# Altium project Microswift REV 2.1B (2L).PrjPcb
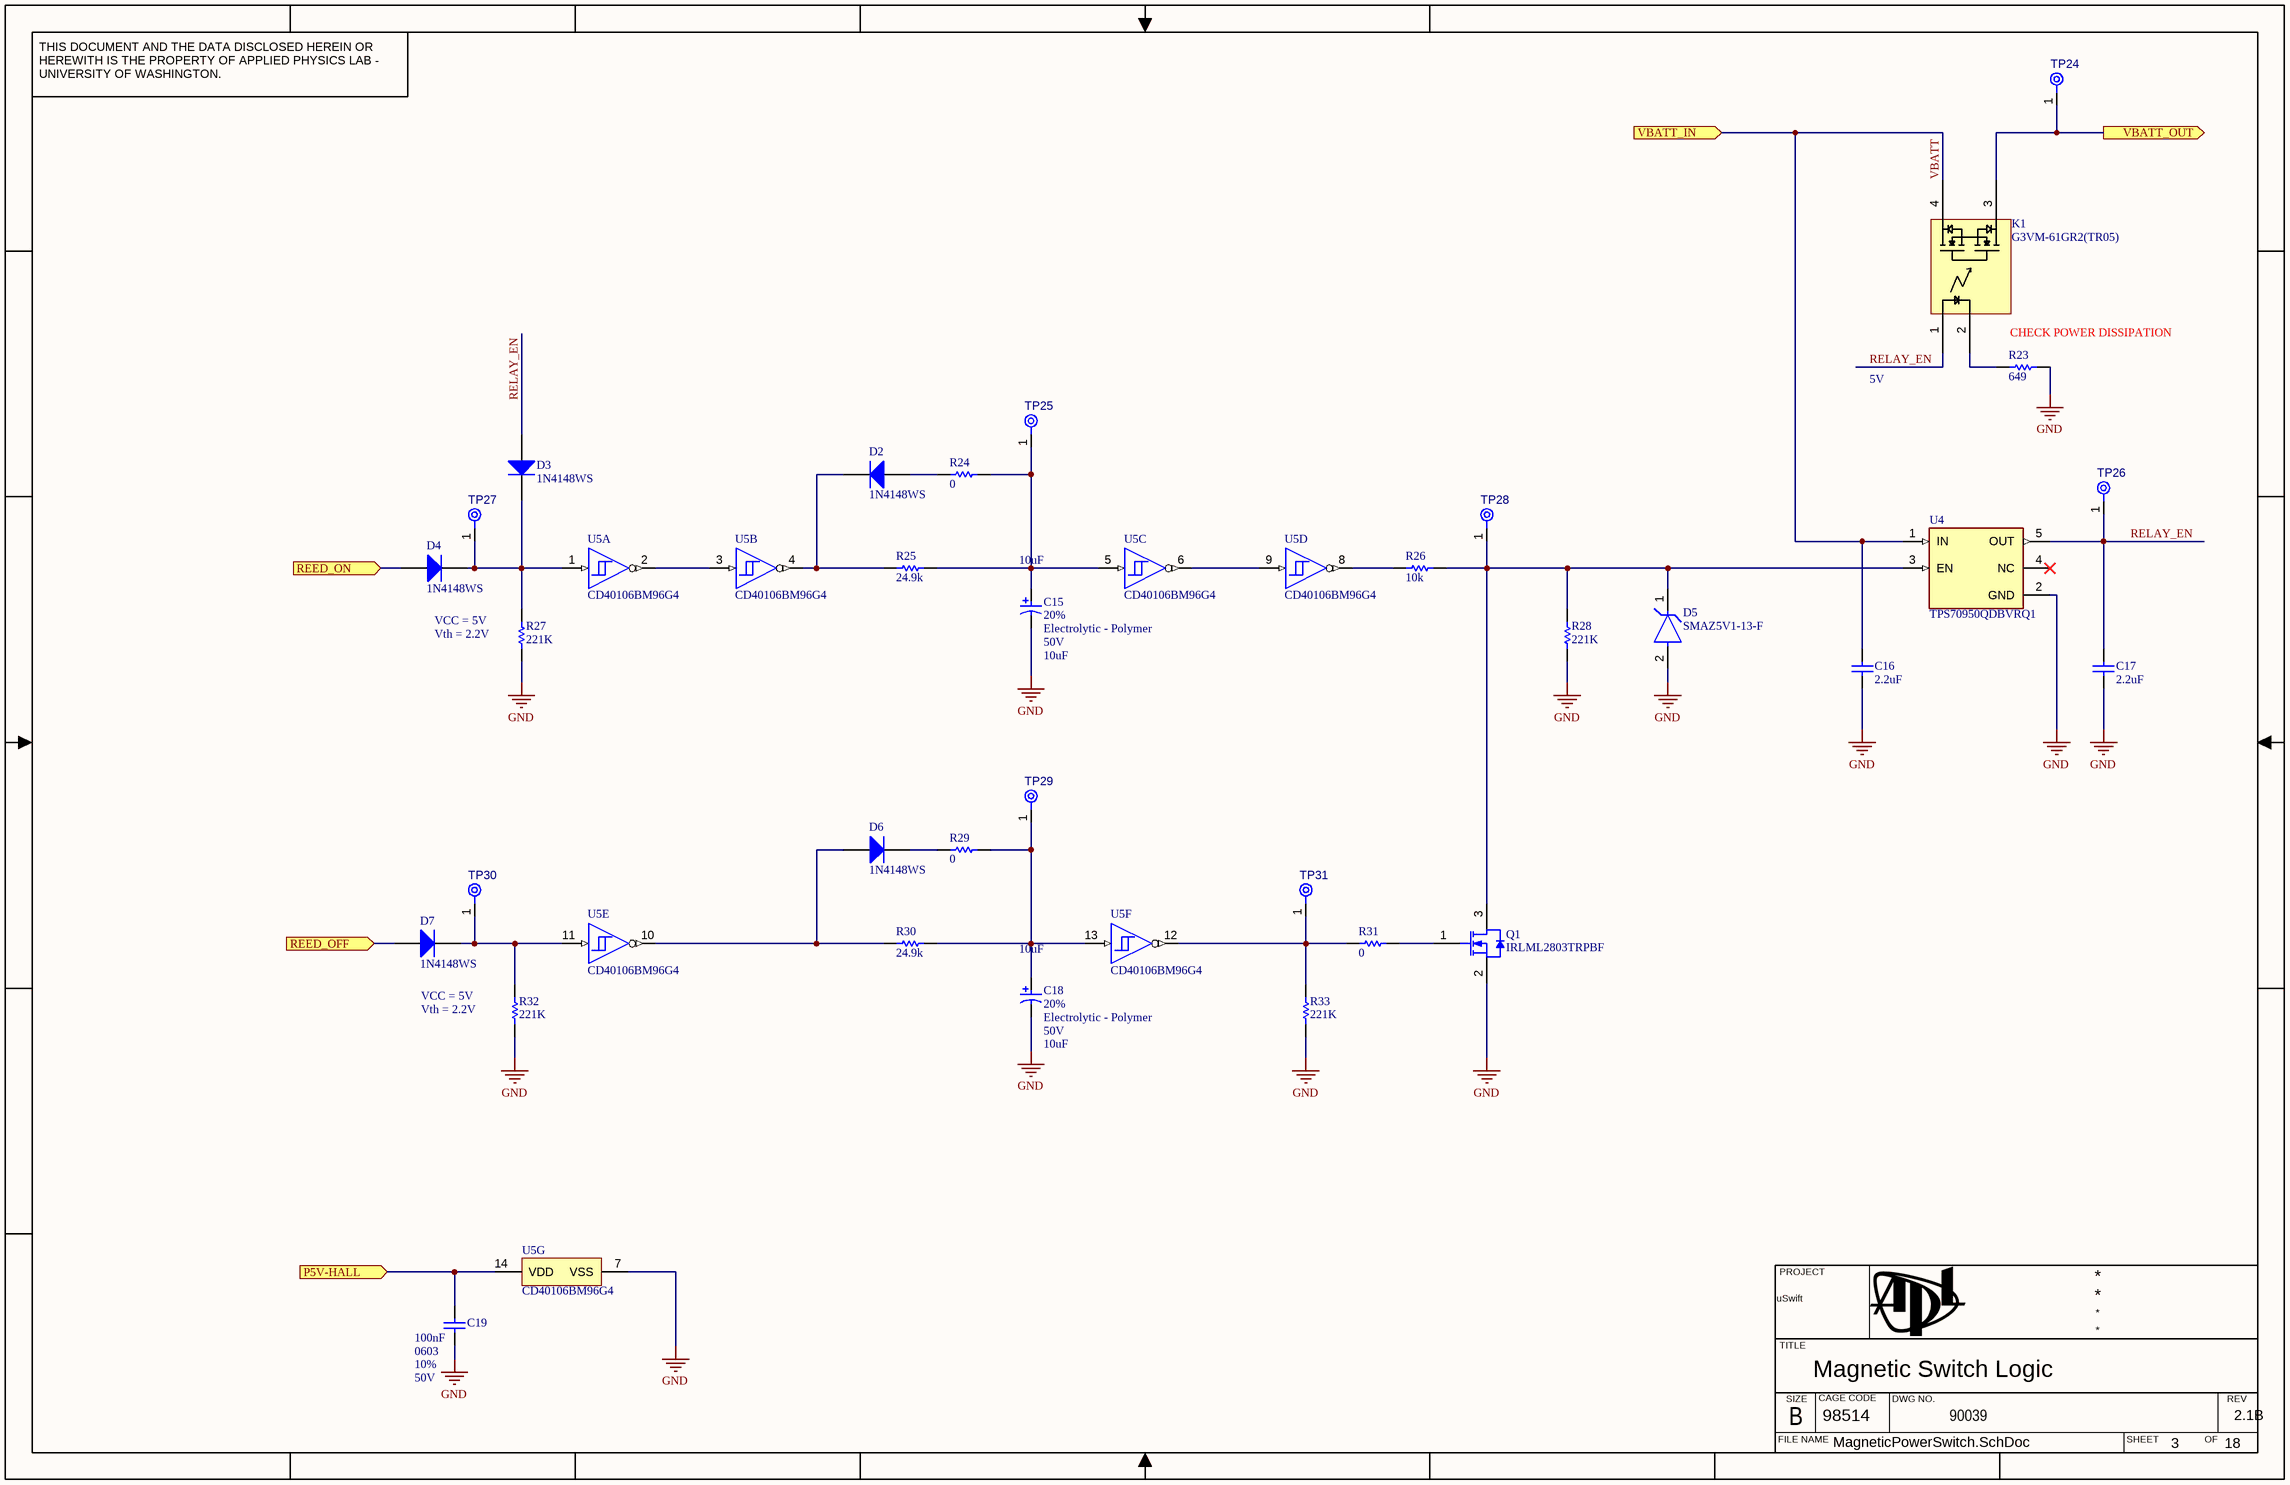
[diagram p0: MagneticPowerSwitch.SchDoc]
Gbl_Revision: 2.1B; Gbl_PROJECTTITLE: MicroSwift 2L PCB; Gbl_Project: uSwift; Gbl_PCB_DWG_NO: 90035; Gbl_ENG_APP_DATE: 2023/04/28; Gbl_Engineer: BSALMI; Gbl_DSN_BOM_DATE: 2024-08-20; Gbl_DSN_APP_DATE: 2024-08-20; Gbl_DrawnBy: BSALMI; Gbl_DOC_NO_SCH_DWG: 90039; Gbl_DOC_NO_FAB_DWG: 90038; Gbl_DOC_NO_BOM: 90037; Gbl_DOC_NO_ASSY_DWG: 90039; GBL_CHK_APP_DATE: 2023/04/28; Gbl_CheckedBy: BCHAM; Gbl_Cage: 98514
3 sheets, 57 parts. Net scope: hierarchical (ports join the sheet entries above them; power ports are global).
Board file: PCB_MicroSwift_2L_6Layer_Sunstone.PcbDoc
Sheets:
  MagneticPowerSwitch.SchDoc
  PowerSwitch_P12V.SchDoc
  P5V_Regulator.SchDoc

## Sheet MagneticPowerSwitch.SchDoc: Magnetic Switch Logic
size 431 x 279 mm; DocumentNumber: 3; SheetNumber: 3; SheetTotal: 18; ENG_APP_DATE: --/--/--; DSN_APP_DATE: --/--/--; CHK_APP_DATE: --/--/--

### Parts
C15  value 10uF  Tolerance: 20%  Material: Electrolytic - Polymer  Voltage Rating: 50V  Capacitance: 10uF  [CAPAE5953X61M]  (hidden comment: EEH-ZA1H100R)
C16  value 2.2uF  [CAPC3225X270X30ML30]  (hidden comment: Capacitor 2.2uF 10%, 50V, X7R, 1210)
C17  value 2.2uF  [CAPC3225X270X30ML30]  (hidden comment: Capacitor 2.2uF 10%, 50V, X7R, 1210)
C18  value 10uF  Tolerance: 20%  Material: Electrolytic - Polymer  Voltage Rating: 50V  Capacitance: 10uF  [CAPAE5953X61M]  (hidden comment: EEH-ZA1H100R)
C19  value 100nF  Case/Package: 0603  Tolerance: 10%  Voltage Rating: 50V  [CAPC1608X90X40ML10T20]  (hidden comment: Capacitor 100nF +/- 10%, 50V, X7R, 0603)
D2  1N4148WS  [FAIR-SOD-323_V]
D3  1N4148WS  [FAIR-SOD-323_V]
D4  1N4148WS  [FAIR-SOD-323_V]
D5  SMAZ5V1-13-F  [FP-SMA-MFG]
D6  1N4148WS  [FAIR-SOD-323_V]
D7  1N4148WS  [FAIR-SOD-323_V]
K1  G3VM-61GR2(TR05)  [G3VM-61GR2(TR05)-Footprint-1]
Q1  IRLML2803TRPBF  [SOT95P237X112-3M]
R23  value 649  [RESC1609X50X30ML08T20]  (hidden comment: Resistor 649R +/-1% 0603 100 mW)
R24  value 0  [RESC1608X55X25ML10T15]  (hidden comment: Resistor 0R +/- 5% 0603 100 mW)
R25  value 24.9k  [RESC1608X55X25ML10T15]  (hidden comment: Resistor 24K9 +/-1% 0603 100 mW)
R26  value 10k  [RESC1608X55X25ML10T15]  (hidden comment: Resistor 10k +/-1% 0603 100 mW)
R27  value 221K  [RESC1609X50X30ML08T20]  (hidden comment: Resistor 221K +/-1% 0603 100 mW)
R28  value 221K  [RESC1609X50X30ML08T20]  (hidden comment: Resistor 221K +/-1% 0603 100 mW)
R29  value 0  [RESC1608X55X25ML10T15]  (hidden comment: Resistor 0R +/- 5% 0603 100 mW)
R30  value 24.9k  [RESC1608X55X25ML10T15]  (hidden comment: Resistor 24K9 +/-1% 0603 100 mW)
R31  value 0  [RESC1608X55X25ML10T15]  (hidden comment: Resistor 0R +/- 5% 0603 100 mW)
R32  value 221K  [RESC1609X50X30ML08T20]  (hidden comment: Resistor 221K +/-1% 0603 100 mW)
R33  value 221K  [RESC1609X50X30ML08T20]  (hidden comment: Resistor 221K +/-1% 0603 100 mW)
TP24  TPAD6R-CIRCLED  [TP06R - Circled]  (value not drawn)  (no BOM)
TP25  TPAD6R-CIRCLED  [TP06R - Circled]  (value not drawn)  (no BOM)
TP26  TPAD6R-CIRCLED  [TP06R - Circled]  (value not drawn)  (no BOM)
TP27  TPAD6R-CIRCLED  [TP06R - Circled]  (value not drawn)  (no BOM)
TP28  TPAD6R-CIRCLED  [TP06R - Circled]  (value not drawn)  (no BOM)
TP29  TPAD6R-CIRCLED  [TP06R - Circled]  (value not drawn)  (no BOM)
TP30  TPAD6R-CIRCLED  [TP06R - Circled]  (value not drawn)  (no BOM)
TP31  TPAD6R-CIRCLED  [TP06R - Circled]  (value not drawn)  (no BOM)
U4  TPS70950QDBVRQ1  [FP-DBV0005A-IPC_A]
U5  CD40106BM96G4  [D0014A_M]  (parts A,B,C,D,E,F,G of 7)

### Ports
P5V-HALL (in), REED_OFF (in), REED_ON (in), VBATT_IN (in), VBATT_OUT (out)

### Nets
GND: C15.2 C16.1 C17.1 C18.2 C19.1 D5.2(A) Q1.2(S) R23.1 R27.1 R28.1 R32.1 R33.1 U4.2(GND) U5.7(VSS)
RELAY_EN: C17.2 D3.1(A) K1.1(+_CNTL) TP26.1(TP) U4.5(OUT)
VBATT: C16.2 K1.4(DRAIN) U4.1(IN) ; port VBATT_IN
NetC15_1: C15.1 R24.2 R25.2 TP25.1(TP) U5.5(C)
NetC18_1: C18.1 R29.2 R30.2 TP29.1(TP) U5.13(F)
NetC19_2: C19.2 U5.14(VDD) ; port P5V-HALL
NetD2_1: D2.1(A) R24.1
NetD2_2: D2.2(K) R25.1 U5.4(H=~{B})
NetD3_2: D3.2(K) D4.2(K) R27.2 TP27.1(TP) U5.1(A)
NetD4_1: D4.1(A) ; port REED_ON
NetD5_1: D5.1(C) Q1.3(D) R26.2 R28.2 TP28.1(TP) U4.3(EN)
NetD6_1: D6.1(A) R30.1 U5.10(K=~{E})
NetD6_2: D6.2(K) R29.1
NetD7_1: D7.1(A) ; port REED_OFF
NetD7_2: D7.2(K) R32.2 TP30.1(TP) U5.11(E)
NetK1_2: K1.2(-_CNTL) R23.2
NetK1_3: K1.3(DRAIN) TP24.1(TP) ; port VBATT_OUT
NetQ1_1: Q1.1(G) R31.2
NetR26_1: R26.1 U5.8(J=~{D})
NetR31_1: R31.1 R33.2 TP31.1(TP) U5.12(L=~{F})
NetU5_2: U5.2(G=~{A}) U5.3(B)
NetU5_6: U5.6(I=~{C}) U5.9(D)

Not connected (* = marked no-connect by the designer): U4 4(NC)*

### Notes on the sheet
- CHECK POWER DISSIPATION
- 5V
- VCC = 5V
- (near R27) Vth = 2.2V
- (near R32) Vth = 2.2V
- THIS DOCUMENT AND THE DATA DISCLOSED HEREIN OR HEREWITH IS THE PROPERTY OF APPLIED PHYSICS LAB - UNIVERSITY OF WASHINGTON.
- PROJECT
- TITLE
- FILE NAME
- SIZE
- B
- CAGE CODE
- DWG NO.
- SHEET
- OF
- REV

### Library data of the parts
C15 C18 = CMP-001-00213-11: Cap Aluminum 10uF 50V 20% (5 X 5.8mm) SMD 0.12 Ohm 750mA 5000 hr 105°C Embossed T/R; Manufacturer: Panasonic; ESR (Equivalent Series Resistance): 120mR; Series: ZA; Min Operating Temperature: -55°C; Max Operating Temperature: 105°C; Mount: Surface Mount; Case/Package: Radial; Decade: 10uF; Ripple Current: 750mA; Part Number: EEH-ZA1H100R
C16 C17 = CMP-001-00182-9: Chip Capacitor, 2.2uF, 10%, 50 V, X7R 1210 (3225 Metric); Decade: 1uF; Capacitor Type: Ceramic; Voltage Rating: 50V; Capacitance: 2.2uF; Max Operating Temperature: 125°C; Pins: 2; Tolerance: 10%; Case/Package: 1210; Min Operating Temperature: -55°C; RoHS Compliant: True; Dielectric: X7R; Mount: Surface Mount
C19 = CMP-001-00206-10: Chip Capacitor, 100nF, +/- 10%, 50 V, X7R 0603 (1608 Metric); Capacitor Type: Ceramic; Dielectric: X7R; Pins: 2; RoHS Compliant: True; Max Operating Temperature: 125°C; Capacitance: 100nF; Min Operating Temperature: -55°C; Decade: 100nF; Mount: Surface Mount
D2-D4 D6 D7 = CMP-004-00001-3: Small Signal Diode, 75 V, 0.15 A, -55 to 150 degC, 2-Pin SOD-323, RoHS, Tape and Reel; Manufacturer: Fairchild; Recovery Time: 4ns; Forward Voltage: 1V; Peak Reverse Current: 5uA; Forward Current: 150mA; Capacitance: -323f; Datasheet URL: https://www.fairchildsemi.com/datasheets/1N/1N4148WS.pdf; Package Reference: SOD-323; Package Description: 2-Pin Small Outline Diode Flat Lead, Body 1.7 x 1.25 mm; Case/Package: SOD-323; Manufacturer URL: https://www.fairchildsemi.com/; Pins: 2; Packaging: TapeandReel; Package Quantity: 3000; Min Operating Temperature: -55°C; RoHS Compliant: True; Max Operating Temperature: 150°C; Datasheet Version: Rev. 1.2, 03/2015; Mount: Surface Mount
D5 = CMP-004-00043-2: Vz=5.1V 4.84V~5.4V Izt=100mA P=1W; Forward Voltage: 1.2V; Impedance: 5; Test Current: 100mA; Zener Voltage: 5.1; Power Rating: 1W; Tolerance: 5%; Element Configuration: Single; Max Reverse Leakage Current: 1uA; Case/Package: SMA; Number of Pins: 2; Height: 2.09mm; Max Operating Temperature: 150°C; Weight: 0.002258oz; Width: 2.92mm; Length: 4.6mm; Min Operating Temperature: -65°C; Voltage Tolerance: 5%; Power Dissipation: 1W; Max Reverse Current: 1uA; Voltage Rating (DC): 5.1; Zener Current: 1uA; Working Voltage: 5.1; Mount: Surface Mount; Max Power Dissipation: 1W; Termination: SMD/SMT
K1 = CMP-008-00015-2: Relay Ssr 25MA 1.48V Dc-in 1.3A 48V Ac/dc-out 4-PIN Sop T/r; On-State Resistance: 130mR; Isolation Voltage: 1.5kV; Load Current: 1.7A; Max Input Voltage: 60V; Min Input Voltage: 0V; Relay Form: SPST-NO; Termination: Gull Wing; Case/Package: SOP; Max Operating Temperature: +85C; Min Operating Temperature: -40C; Mount: Surface Mount
Q1 = CMP-013-00048-3: Mosfet, Power; N-ch; Vdss 30V; Rds(on) 0.25 Ohm; Id 1.2A; MICRO3; Pd 540MW; Vgs +/-20V; Manufacturer: International Rectifier; Threshold Voltage: 1V; Rds On Max: 250mR; Gate to Source Voltage (Vgs): 20V; Transistor Type: NMOS; Max Power Dissipation: 540mW; Case/Package: SOT-23; Min Operating Temperature: -55°C; Drain to Source Breakdown Voltage: 30V; Max Operating Temperature: 150°C; Mount: Surface Mount
R23 = CMP-009-00771-5: Chip Resistor, 649 Ohm, +/- 1%, 0.1 W, -55 to 155 degC, 0603 (1608 Metric); Voltage Rating: 75V; Power: 100mW; Decade: 100; Pins: 2; RoHS Compliant: Yes; Max Operating Temperature: 155°C; Case/Package: 0603; Min Operating Temperature: -55°C; Tolerance: 1%; Mount: Surface Mount
R24 R29 R31 = CMP-009-00006-7: Chip Resistor, 0 Ohm, 0.1 W, -55 to 155 degC, 0603 (1608 Metric); Voltage Rating: 50V; Power: 100mW; RoHS Compliant: True; Max Operating Temperature: 155°C; Tolerance: 5%; Min Operating Temperature: -55°C; Case/Package: 0603; Pins: 2; Mount: Surface Mount; Decade: 0
R25 R30 = CMP-009-00972-4: Chip Resistor, 24.9k Ohm, +/- 1%, 0.1 W, -55 to 155 degC, 0603 (1608 Metric); Power: 100mW; Decade: 10k; Voltage Rating: 75V; RoHS Compliant: True; Tolerance: 1%; Case/Package: 0603; Min Operating Temperature: -55°C; Max Operating Temperature: 155°C; Pins: 2; Mount: Surface Mount
R26 = CMP-009-00017-8: Chip Resistor, 10 KOhm, +/- 1%, 01 W, -55 to 155 degC, 0603 (1608 Metric); Voltage Rating: 50V; Power: 100mW; Min Operating Temperature: -55°C; Case/Package: 0603; Tolerance: 1%; Max Operating Temperature: 155°C; RoHS Compliant: True; Pins: 2; Decade: 10k; Mount: Surface Mount
R27 R28 R32 R33 = CMP-009-00908-2: Chip Resistor, 221k Ohm, +/- 1%, 0.1 W, -55 to 155 degC, 0603 (1608 Metric); Decade: 100k; Voltage Rating: 75V; Power: 100mW; Pins: 2; Case/Package: 0603; Min Operating Temperature: -55°C; RoHS Compliant: Yes; Max Operating Temperature: 155°C; Tolerance: 1%; Mount: Surface Mount
TP24-TP31 = CMP-00028-00014-3: 0.6mm round with a silkscreen circle.; Pins: 1
U4 = CMP-019-00075-3: LDO Regulator Pos 5V 0.15A 5-Pin SOT-23 T/R; Max Input Voltage: 30V; Regulator Type: Linear; Polarity: Positive; Max Output Current: 150mA; Dropout Voltage: 690mV; Isolation: No; Min Input Voltage: 2.7V; Max Operating Temperature: 125°C; Min Operating Temperature: -40°C; Case/Package: SOT-23-5; Switching Frequency: N/A; Output Voltage: 5V; Isolation Voltage: N/A; Mount: Surface Mount
U5 = CMP-016-00020-4: 6-ch, 3-V to 18-V inverters with Schmitt-Trigger inputs 14-SOIC -55 to 125; Max Supply Voltage: 18V; Logic Function: Buffer,Inverter,Schmitt Trigger; Elements: 6; Min Supply Voltage: 3V; Max Operating Temperature: 125°C; Case/Package: 14-SOIC; Min Operating Temperature: -55°C; Mount: Surface Mount

## Sheet PowerSwitch_P12V.SchDoc: 3.3V Load Switch
size 431 x 279 mm; DocumentNumber: 7; SheetNumber: 7; SheetTotal: 18; ENG_APP_DATE: --/--/--; DSN_APP_DATE: --/--/--; CHK_APP_DATE: --/--/--
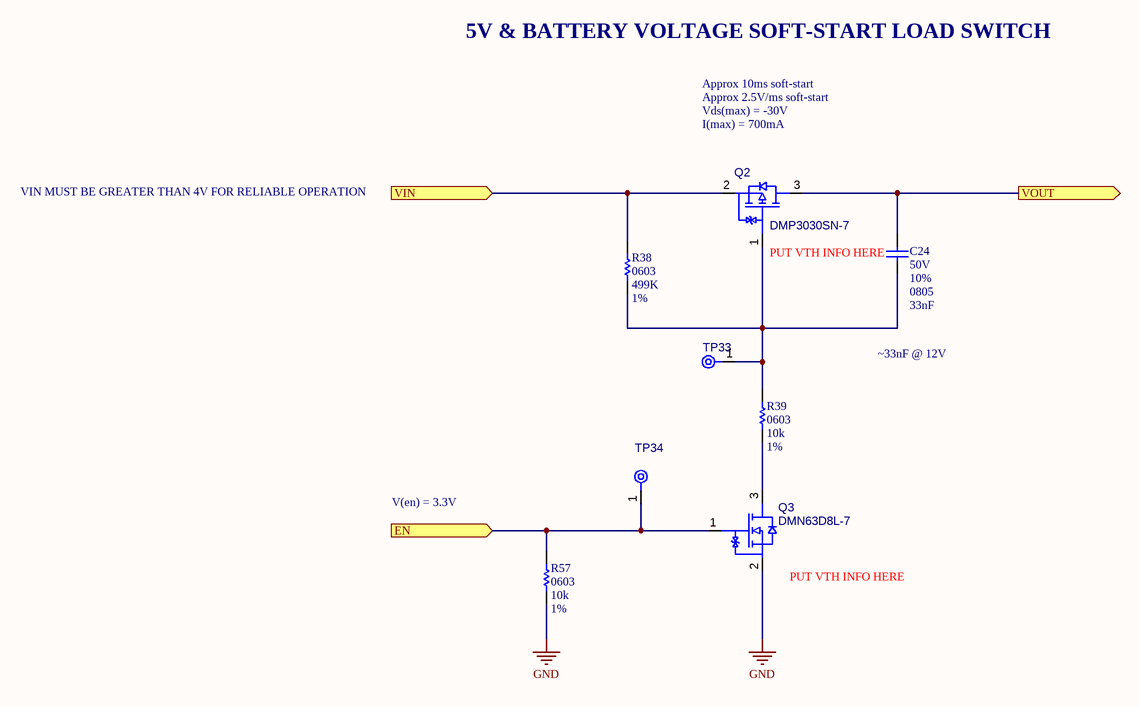
[diagram p1: PowerSwitch_P12V.SchDoc]

### Parts
C24  value 33nF  Voltage Rating: 50V  Tolerance: 10%  Case/Package: 0805  [CAPC2013X95X50ML10T25]  (hidden comment: Capacitor 33nF 10%, 50V, X7R, 0805)
Q2  DMP3030SN-7  [SOT95P164X140-3M]
Q3  DMN63D8L-7  [SOT95P240X110-3M]
R38  value 499K  Case/Package: 0603  Tolerance: 1%  [RESC1609X50X30ML08T20]  (hidden comment: Resistor 499K +/-1% 0603 100 mW)
R39  value 10k  Case/Package: 0603  Tolerance: 1%  [RESC1608X55X25ML10T15]  (hidden comment: Resistor 10k +/-1% 0603 100 mW)
R57  value 10k  Case/Package: 0603  Tolerance: 1%  [RESC1608X55X25ML10T15]  (hidden comment: Resistor 10k +/-1% 0603 100 mW)
TP33  TPAD6R-CIRCLED  [TP06R - Circled]  (value not drawn)  (no BOM)
TP34  TPAD6R-CIRCLED  [TP06R - Circled]  (value not drawn)  (no BOM)

### Ports
EN (in), VIN (in), VOUT (out)

### Nets
GND: Q3.2(S) R57.1
NetC24_1: C24.1 Q2.1(G) R38.1 R39.2 TP33.1(TP)
NetC24_2: C24.2 Q2.3(D) ; port VOUT
NetQ2_2: Q2.2(S) R38.2 ; port VIN
NetQ3_1: Q3.1(G) R57.2 TP34.1(TP) ; port EN
NetQ3_3: Q3.3(D) R39.1

### Notes on the sheet
- 5V & BATTERY VOLTAGE SOFT-START LOAD SWITCH
- Approx 10ms soft-start
- Approx 2.5V/ms soft-start
- Vds(max) = -30V
- I(max) = 700mA
- VIN MUST BE GREATER THAN 4V FOR RELIABLE OPERATION
- (near Q2) PUT VTH INFO HERE
- ~33nF @ 12V
- V(en) = 3.3V
- (near Q3) PUT VTH INFO HERE
- THIS DOCUMENT AND THE DATA DISCLOSED HEREIN OR HEREWITH IS THE PROPERTY OF APPLIED PHYSICS LAB - UNIVERSITY OF WASHINGTON.
- PROJECT
- TITLE
- FILE NAME
- SIZE
- B
- CAGE CODE
- DWG NO.
- SHEET
- OF
- REV

### Library data of the parts
C24 = CMP-001-00133-11: Chip Capacitor, 33nF, 10%, 50 V, X7R 0805 (2012 Metric); Capacitor Type: Ceramic; Decade: 10nF; Capacitance: 33nF; Pins: 2; RoHS Compliant: True; Min Operating Temperature: -55°C; Max Operating Temperature: 125°C; Dielectric: X7R; Mount: Surface Mount
Q2 = CMP-013-00050-4: Trans Mosfet P-ch 30V 0.7A 3-PIN SC-59 T/r / Mosfet P-ch 30V 700MA SC59-3; Drain to Source Breakdown Voltage: -30V; Polarity: P-CHANNEL; Max Power Dissipation: 500mW; Rds On Max: 250mR; Transistor Type: PMOS; Min Operating Temperature: -65°C; Power Dissipation: 500mW; Case/Package: SOT-23-3; Max Operating Temperature: 150°C; Mount: Surface Mount
Q3 = CMP-013-00051-2: Trans Mosfet N-ch 30V 0.35A 3-PIN SOT-23 T/r; Rds On Max: 2.8R; Max Power Dissipation: 350mW; Continuous Drain Current (ID): 350mA; Transistor Type: NMOS; Drain to Source Voltage (Vdss): 30V; Max Operating Temperature: 150°C; Mount: Surface Mount; Min Operating Temperature: -55°C; Case/Package: SOT-23-3
R38 = CMP-009-01036-2: Chip Resistor, 499k Ohm, +/- 1%, 0.1 W, -55 to 155 degC, 0603 (1608 Metric); Power: 100mW; Voltage Rating: 75V; Decade: 100k; RoHS Compliant: Yes; Max Operating Temperature: 155°C; Min Operating Temperature: -55°C; Pins: 2; Mount: Surface Mount
R39 R57 = CMP-009-00017-8: Chip Resistor, 10 KOhm, +/- 1%, 01 W, -55 to 155 degC, 0603 (1608 Metric); Power: 100mW; Voltage Rating: 50V; RoHS Compliant: True; Max Operating Temperature: 155°C; Min Operating Temperature: -55°C; Pins: 2; Decade: 10k; Mount: Surface Mount
TP33 TP34 = CMP-00028-00014-3: 0.6mm round with a silkscreen circle.; Pins: 1

## Sheet P5V_Regulator.SchDoc: P5V DC/DC Converter
size 431 x 279 mm; Organization: ORGANIZATION; Address1: APPLIED PHYSICS LAB; Address2: UNIVERSITY OF WASHINGTON; Address3: 1013 NE 40TH STREET; Address4: SEATTLE, WA 98105; DocumentNumber: 6; Revision: -; SheetNumber: 6; SheetTotal: 18; ENG_APP_DATE: --/--/--; DSN_APP_DATE: --/--/--; CHK_APP_DATE: --/--/--
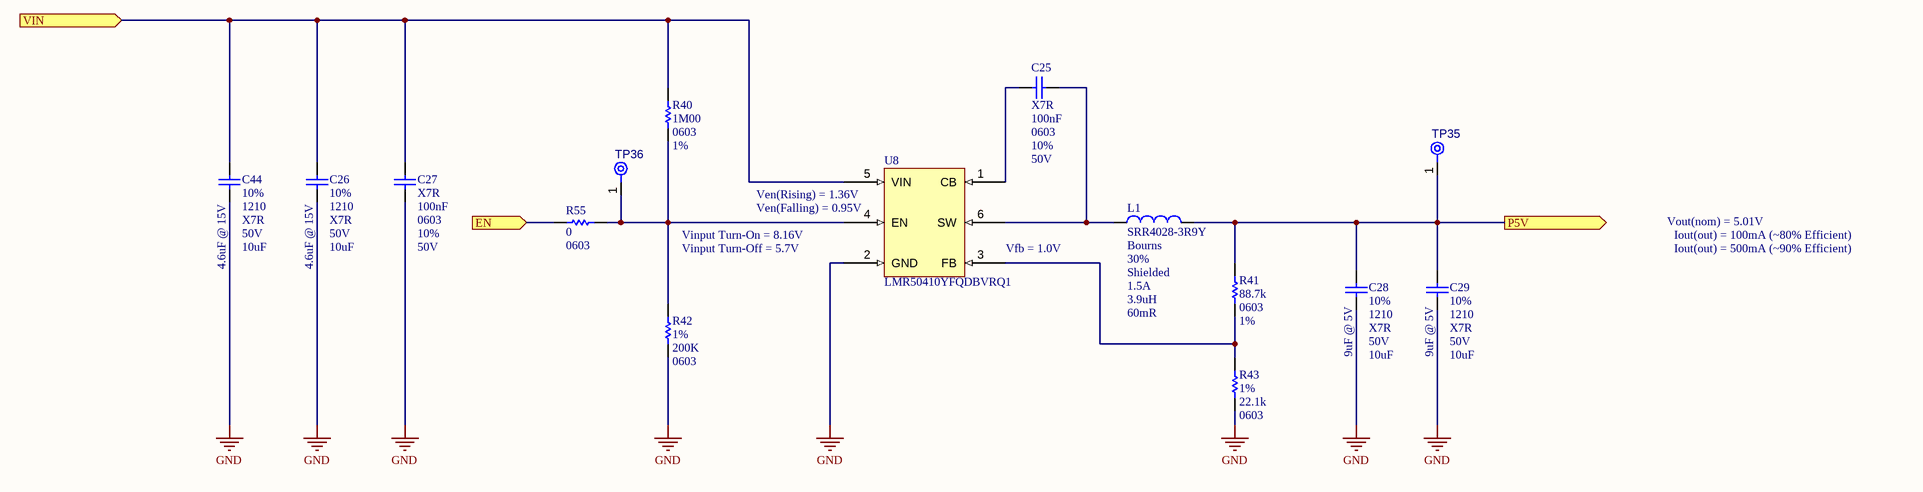
[diagram p2: P5V_Regulator.SchDoc]

### Parts
C25  value 100nF  Dielectric: X7R  Case/Package: 0603  Tolerance: 10%  Voltage Rating: 50V  [CAPC1608X90X40ML10T20]  (hidden comment: Capacitor 100nF +/- 10%, 50V, X7R, 0603)
C26  value 10uF  Tolerance: 10%  Case/Package: 1210  Dielectric: X7R  Voltage Rating: 50V  [CAPC3225X270X30ML30]  (hidden comment: Capacitor 10uF 10%, 50V, X7R, 1210)
C27  value 100nF  Dielectric: X7R  Case/Package: 0603  Tolerance: 10%  Voltage Rating: 50V  [CAPC1608X90X40ML10T20]  (hidden comment: Capacitor 100nF +/- 10%, 50V, X7R, 0603)
C28  value 10uF  Tolerance: 10%  Case/Package: 1210  Dielectric: X7R  Voltage Rating: 50V  [CAPC3225X270X30ML30]  (hidden comment: Capacitor 10uF 10%, 50V, X7R, 1210)
C29  value 10uF  Tolerance: 10%  Case/Package: 1210  Dielectric: X7R  Voltage Rating: 50V  [CAPC3225X270X30ML30]  (hidden comment: Capacitor 10uF 10%, 50V, X7R, 1210)
C44  value 10uF  Tolerance: 10%  Case/Package: 1210  Dielectric: X7R  Voltage Rating: 50V  [CAPC3225X270X30ML30]  (hidden comment: Capacitor 10uF 10%, 50V, X7R, 1210)
L1  SRR4028-3R9Y  Manufacturer: Bourns  Inductance Tolerance: 30%  Shielding: Shielded  Saturation Current: 1.5A  Inductance: 3.9uH  DC Resistance (DCR): 60mR  [INDP4848X30M]
R40  value 1M00  Case/Package: 0603  Tolerance: 1%  [RESC1609X50X30ML08T20]  (hidden comment: Resistor 1M +/-1% 0603 100 mW)
R41  value 88.7k  Case/Package: 0603  Tolerance: 1%  [RESC1608X55X25ML10T15]  (hidden comment: Resistor 88K7 +/-1% 0603 100 mW)
R42  value 200K  Tolerance: 1%  Case/Package: 0603  [RESC1609X50X30ML08T20]  (hidden comment: Resistor 200K +/-1% 0603 100 mW)
R43  value 22.1k  Tolerance: 1%  Case/Package: 0603  [RESC1608X55X25ML10T15]  (hidden comment: Resistor 22K1 +/-1% 0603 100 mW)
R55  value 0  Case/Package: 0603  [RESC1608X55X25ML10T15]  (hidden comment: Resistor 0R +/- 5% 0603 100 mW)
TP35  TPAD6R-CIRCLED  [TP06R - Circled]  (value not drawn)  (no BOM)
TP36  TPAD6R-CIRCLED  [TP06R - Circled]  (value not drawn)  (no BOM)
U8  LMR50410YFQDBVRQ1  [SOT95P280X145-6M]

### Ports
EN (in), P5V (out), VIN (in)

### Nets
GND: C26.1 C27.1 C28.1 C29.1 C44.1 R42.1 R43.1 U8.2(GND)
NetC25_1: C25.1 L1.1 U8.6(SW)
NetC25_2: C25.2 U8.1(CB)
NetC26_2: C26.2 C27.2 C44.2 R40.2 U8.5(VIN) ; port VIN
NetC28_2: C28.2 C29.2 L1.2 R41.1 TP35.1(TP) ; port P5V
NetR40_1: R40.1 R42.2 R55.1 TP36.1(TP) U8.4(EN)
NetR41_2: R41.2 R43.2 U8.3(FB)
NetR55_2: R55.2 ; port EN

### Notes on the sheet
- Vinput Turn-On = 8.16V
- (near U8) Ven(Rising) = 1.36V
- (near U8) Ven(Falling) = 0.95V
- Vout(nom) = 5.01V
- Iout(out) = 100mA (~80% Efficient)
- (near C44) 4.6uF @ 15V
- (near C26) 4.6uF @ 15V
- Vinput Turn-Off = 5.7V
- Vfb = 1.0V
- Iout(out) = 500mA (~90% Efficient)
- (near C28) 9uF @ 5V
- (near C29) 9uF @ 5V
- THIS DOCUMENT AND THE DATA DISCLOSED HEREIN OR HEREWITH IS THE PROPERTY OF APPLIED PHYSICS LAB - UNIVERSITY OF WASHINGTON.
- PROJECT
- TITLE
- FILE NAME
- SIZE
- B
- CAGE CODE
- DWG NO.
- SHEET
- OF
- REV

### Library data of the parts
C25 C27 = CMP-001-00206-10: as C19 on sheet MagneticPowerSwitch; Pins: 2; RoHS Compliant: True; Max Operating Temperature: 125°C; Capacitance: 100nF; Min Operating Temperature: -55°C; Decade: 100nF; Mount: Surface Mount
C26 C28 C29 C44 = CMP-001-00184-10: Chip Capacitor, 10uF, 10%, 50 V, X7R 1210 (3225 Metric); Capacitor Type: Ceramic; Min Operating Temperature: -55°C; Max Operating Temperature: 125°C; Capacitance: 10uF; Decade: 10uF; Pins: 2; RoHS Compliant: True; Mount: Surface Mount
L1 = CMP-006-00033-4: Inductor Power Shielded Wirewound 3.9uH 30% 8.58 Q-Factor Ferrite 1.5A Saturation 60mROhm DCR; Decade: 1uH; Current Rating: 1.72A; Q Factor: 8.58; Self Resonant Frequency: 56MHz; Mount: Surface Mount; Series: SRR4028; Core Material: Ferrite; Min Operating Temperature: -40°C; Max Operating Temperature: 125°C; Case/Package: 2020
R40 = CMP-009-01187-3: Chip Resistor, 1M Ohm, +/- 1%, 0.1 W, -55 to 155 degC, 0603 (1608 Metric); Decade: 1MEG; Power: 100mW; Voltage Rating: 75V; RoHS Compliant: Yes; Max Operating Temperature: 155°C; Pins: 2; Min Operating Temperature: -55°C; Mount: Surface Mount
R41 = CMP-009-01025-4: Chip Resistor, 88.7k Ohm, +/- 1%, 0.1 W, -55 to 155 degC, 0603 (1608 Metric); Voltage Rating: 75V; Decade: 10k; Power: 100mW; Pins: 2; RoHS Compliant: True; Max Operating Temperature: 155°C; Min Operating Temperature: -55°C; Mount: Surface Mount
R42 = CMP-009-00904-2: Chip Resistor, 200k Ohm, +/- 1%, 0.1 W, -55 to 155 degC, 0603 (1608 Metric); Power: 100mW; Voltage Rating: 75V; Decade: 100k; RoHS Compliant: Yes; Max Operating Temperature: 155°C; Pins: 2; Min Operating Temperature: -55°C; Mount: Surface Mount
R43 = CMP-009-00967-4: Chip Resistor, 22.1k Ohm, +/- 1%, 0.1 W, -55 to 155 degC, 0603 (1608 Metric); Decade: 10k; Power: 100mW; Voltage Rating: 75V; Min Operating Temperature: -55°C; Pins: 2; RoHS Compliant: True; Max Operating Temperature: 155°C; Mount: Surface Mount
R55 = CMP-009-00006-7: as R24 on sheet MagneticPowerSwitch; RoHS Compliant: True; Max Operating Temperature: 155°C; Tolerance: 5%; Min Operating Temperature: -55°C; Pins: 2; Mount: Surface Mount; Decade: 0
TP35 TP36 = CMP-00028-00014-3: 0.6mm round with a silkscreen circle.; Pins: 1
U8 = CMP-019-00074-3: Automotive qualified SIMPLE SWITCHER 4-V to 36-V, 1-A synchronous step-down converter 6-SOT-23 -40 to 150; Max Input Voltage: 4V; Switching Frequency: 0.7MHz; Min Output Voltage: 28V; Max Output Current: 1; Min Input Voltage: 36V; Isolation: No; Max Output Voltage: 1V; Min Operating Temperature: +150; Isolation Voltage: N/A; Nominal Output Voltage: N/A; Case/Package: SOT-23-6; Mount: Surface Mount; Max Operating Temperature: -40; Max Power Dissipation: N/A

## Nets that join several sheets
GND: MagneticPowerSwitch (14 pins), PowerSwitch_P12V (Q3.2 R57.1), P5V_Regulator (8 pins)

## Assembly variants
Flight Variant: not fitted C9 C10 C11 C12 C13 C14 C22 C23 C35C C40 C41 C42 C43 C46 Q4C Q5C R1 R4 R5 R9 R10 R13 R14 R15 R16 R17 R18 R19 R20 R21 R22 R48C R49C R56 R58C TP1 TP5 TP6 TP7 TP8 TP9 TP10 TP12 TP13 TP23 TP39C TP40C U3 U7 U13 U14 X1
Test Variant: not fitted C46 R1 R4 R5 R9 R10 R18 R19 R20 R56